# EAGLE design LMP91002 (EAGLE 7.5.0)
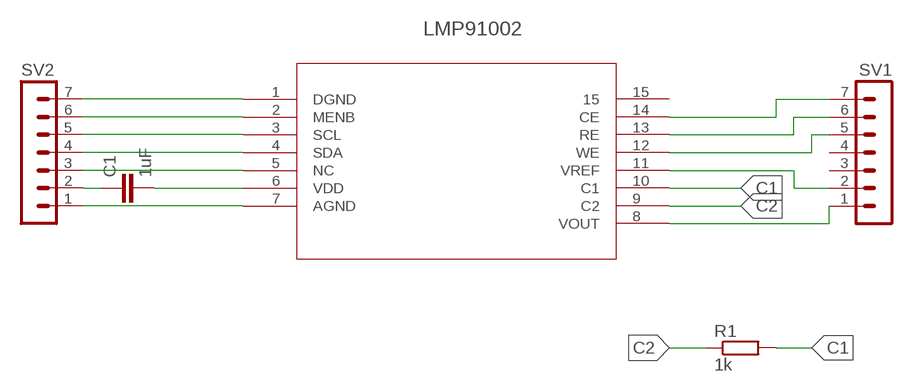
[diagram p0: schematic, sheet 1]

## Parts
C1  1uF  C-EUC0805  [C0805]
LMP91002  LMP91000_NHL_14  [SDA14B]
R1  1k  R-EU_M0805  [M0805]
SV1  MA07-1  [MA07-1]
SV2  MA07-1  [MA07-1]

## Nets
C1: LMP91002.10(C1) R1.2
C2: LMP91002.9(C2) R1.1
N$1: LMP91002.7(AGND) SV2.1
N$2: LMP91002.14(CE) SV1.7
N$3: LMP91002.13(RE) SV1.6
N$4: LMP91002.1(DGND) SV2.7
N$5: LMP91002.12(WE) SV1.5
N$6: LMP91002.11(VREF) SV1.2
N$7: LMP91002.3(SCL) SV2.5
N$8: LMP91002.8(VOUT) SV1.1
N$9: LMP91002.2(MENB) SV2.6
N$11: LMP91002.4(SDA) SV2.4
N$12: LMP91002.5(NC) SV2.3
N$13: C1.1 SV2.2
N$14: C1.2 LMP91002.6(VDD)
Unconnected: LMP91002.15 SV1.3 SV1.4

## Library data of the parts
C1 = rcl:C-EU: CAPACITOR, European symbol
LMP91002 = LMP91002:LMP91000_NHL_14; BASEPN: LMP91000; DATASHEETURL: http://www.ti.com/lit/ds/symlink/lmp91000.pdf; DESCRIPTION: Configurable AFE Potentiostat for Low-Power Chemical Sensing Applications; MANUFACTURER: Texas Instruments; MANUFACTURER_PART_NUMBER: lmp91000_nhl_14; NSC_PACKAGEREFERENCE: SDA14B; OC_NEWARK: unknown; VENDOR: Texas Instruments
R1 = rcl:R-EU_: RESISTOR, European symbol
SV1 SV2 = con-lstb:MA07-1: PIN HEADER; OC_FARNELL: unknown; OC_NEWARK: unknown

## Net classes
0 default: width 0.305 mm, drill 0.508 mm, clearance 0.254 mm

## Board
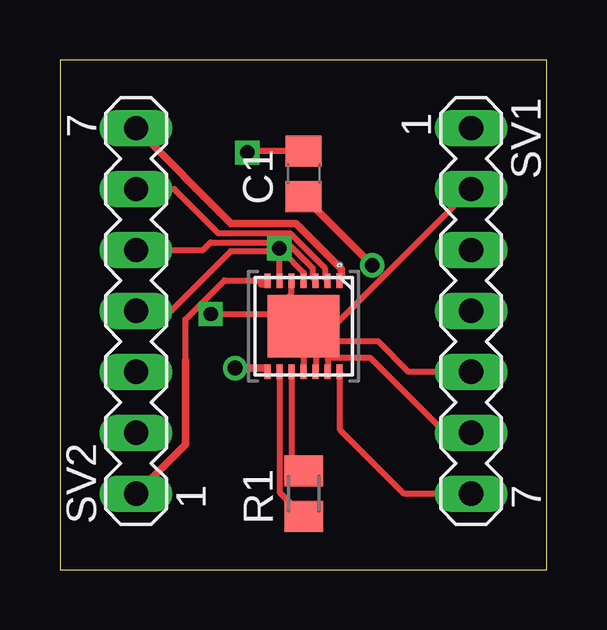
[diagram p1: board, top side]
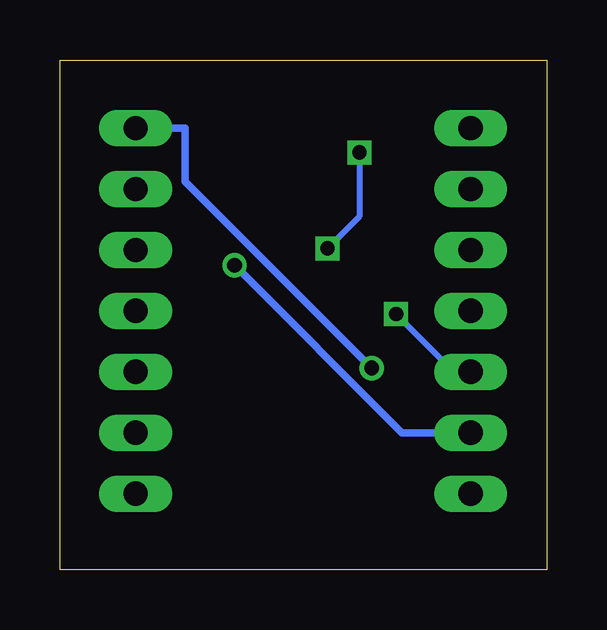
[diagram p2: board, bottom side, seen from below]

Size 20.3 x 21.26 mm. Coordinates in mm from the lower left corner, seen from the top.
Outline: 0,0 20.3,0 20.3,21.26 0,21.26 0,0
Copper layers (1*16): Top 0.035mm / dielectric 1.5mm / Bottom 0.035mm
Design rules "default": minimum track width 10mil, minimum drill 24mil, track to track 8mil, track to pad 8mil, pad to pad 8mil, via to via 8mil, smd to smd 8mil, copper to edge 40mil, drill to drill 8mil, minimum pad ring 10mil, minimum via ring 8mil, stop-mask expansion 4mil, vias tented up to drill 0mil, thermal gap 10mil

### Footprints (pad centres in the part's own frame; a part is rotated, then mirrored left to right if it is on the bottom)
C0805 = smd 1.3 x 1.5: 1 -0.95,0; 2 0.95,0
SDA14B = smd 0.6 x 0.25: 1 -1.9,1.5; 2 -1.9,1; 3 -1.9,0.5; 4 -1.9,0; 5 -1.9,-0.5; 6 -1.9,-1; 7 -1.9,-1.5; 8 1.9,-1.5; 9 1.9,-1; 10 1.9,-0.5; 11 1.9,0; 12 1.9,0.5; 13 1.9,1; 14 1.9,1.5 | smd 2.6 x 3: 15 0,0
M0805 = smd 1.3 x 1.6: 1 -0.95,0; 2 0.95,0
MA07-1 = drill 1.016 long: 1 -7.62,0; 2 -5.08,0; 3 -2.54,0; 4 0,0; 5 2.54,0; 6 5.08,0; 7 7.62,0

### Placement (x,y rotation side)
C1  10.16,16.51 90 top
LMP91002  10.16,10.16 270 top
R1  10.16,3.17 90 top
SV1  17.14,10.79 270 top
SV2  3.17,10.79 90 top

### Tracks (layer width: path | path; a pad name or v marks a point on that pad's centre or on a via)
C1
  Top 0.254: LMP91002.10 9.66,4.62 R1.2
C2
  Top 0.254: LMP91002.9 9.16,3.23 R1.1
N$1
  Top 0.254: 5.24,8.73 5.24,10.45 6.86,12.06 LMP91002.7
  Top 0.305: 8.41,11.91 8.57,11.91 LMP91002.7 | 5.24,8.73 5.24,5.24 SV2.1
N$2
  Top 0.254: SV1.7 14.35,3.17 11.68,5.84 11.68,8.24 LMP91002.14
N$3
  Top 0.254: SV1.6 16.07,5.71 12.95,8.83 11.24,8.83 11.18,8.76 11.18,8.28 LMP91002.13
N$4
  Top 0.305: SV2.7 7.14,14.45 9.84,14.45 11.75,12.54 11.75,12.06 LMP91002.1
N$5
  Top 0.254: SV1.5 14.54,8.26 13.27,9.53 10.79,9.53 10.67,9.4 LMP91002.12
N$6
  Top 0.254: SV1.2 10.16,8.89 LMP91002.11
N$7
  Top 0.254: SV2.5 5.97,13.34 6.29,13.65 9.53,13.65 9.53,13.59 10.54,12.57 10.54,12.18 LMP91002.3
N$8  (via drill 0.61)
  Top 0.305: v7.3,8.41 8.57,8.41 LMP91002.8
  Bottom 0.305: v7.3,8.41 15.08,16.19 15.08,18.41 SV1.1
N$9
  Top 0.254: SV2.6 4.76,15.88 6.6,14.03 9.59,14.03 11.05,12.57 11.05,12.17 LMP91002.2
N$11
  Top 0.254: SV2.4 4.64,10.79 7.11,13.27 9.27,13.27 10.16,12.38 LMP91002.4
N$12  (via drill 0.6)
  Top 0.254: v6.29,10.67 8.83,10.67 9.65,11.49 LMP91002.5
  Bottom 0.254: SV2.3 3.87,8.26 v6.29,10.67
N$13  (via drill 0.61)
  Top 0.305: v13.02,12.7 C1.1
  Bottom 0.305: v13.02,12.7 6.03,5.71 SV2.2
N$14  (via drill 0.6)
  Top 0.254: C1.2 7.87,17.46 v7.81,17.4 | v9.14,13.4 9.14,12.08 LMP91002.6
  Bottom 0.254: v7.81,17.4 7.81,14.73 v9.14,13.4